# EAGLE design RAMPS_1-41_n (EAGLE 5.11)
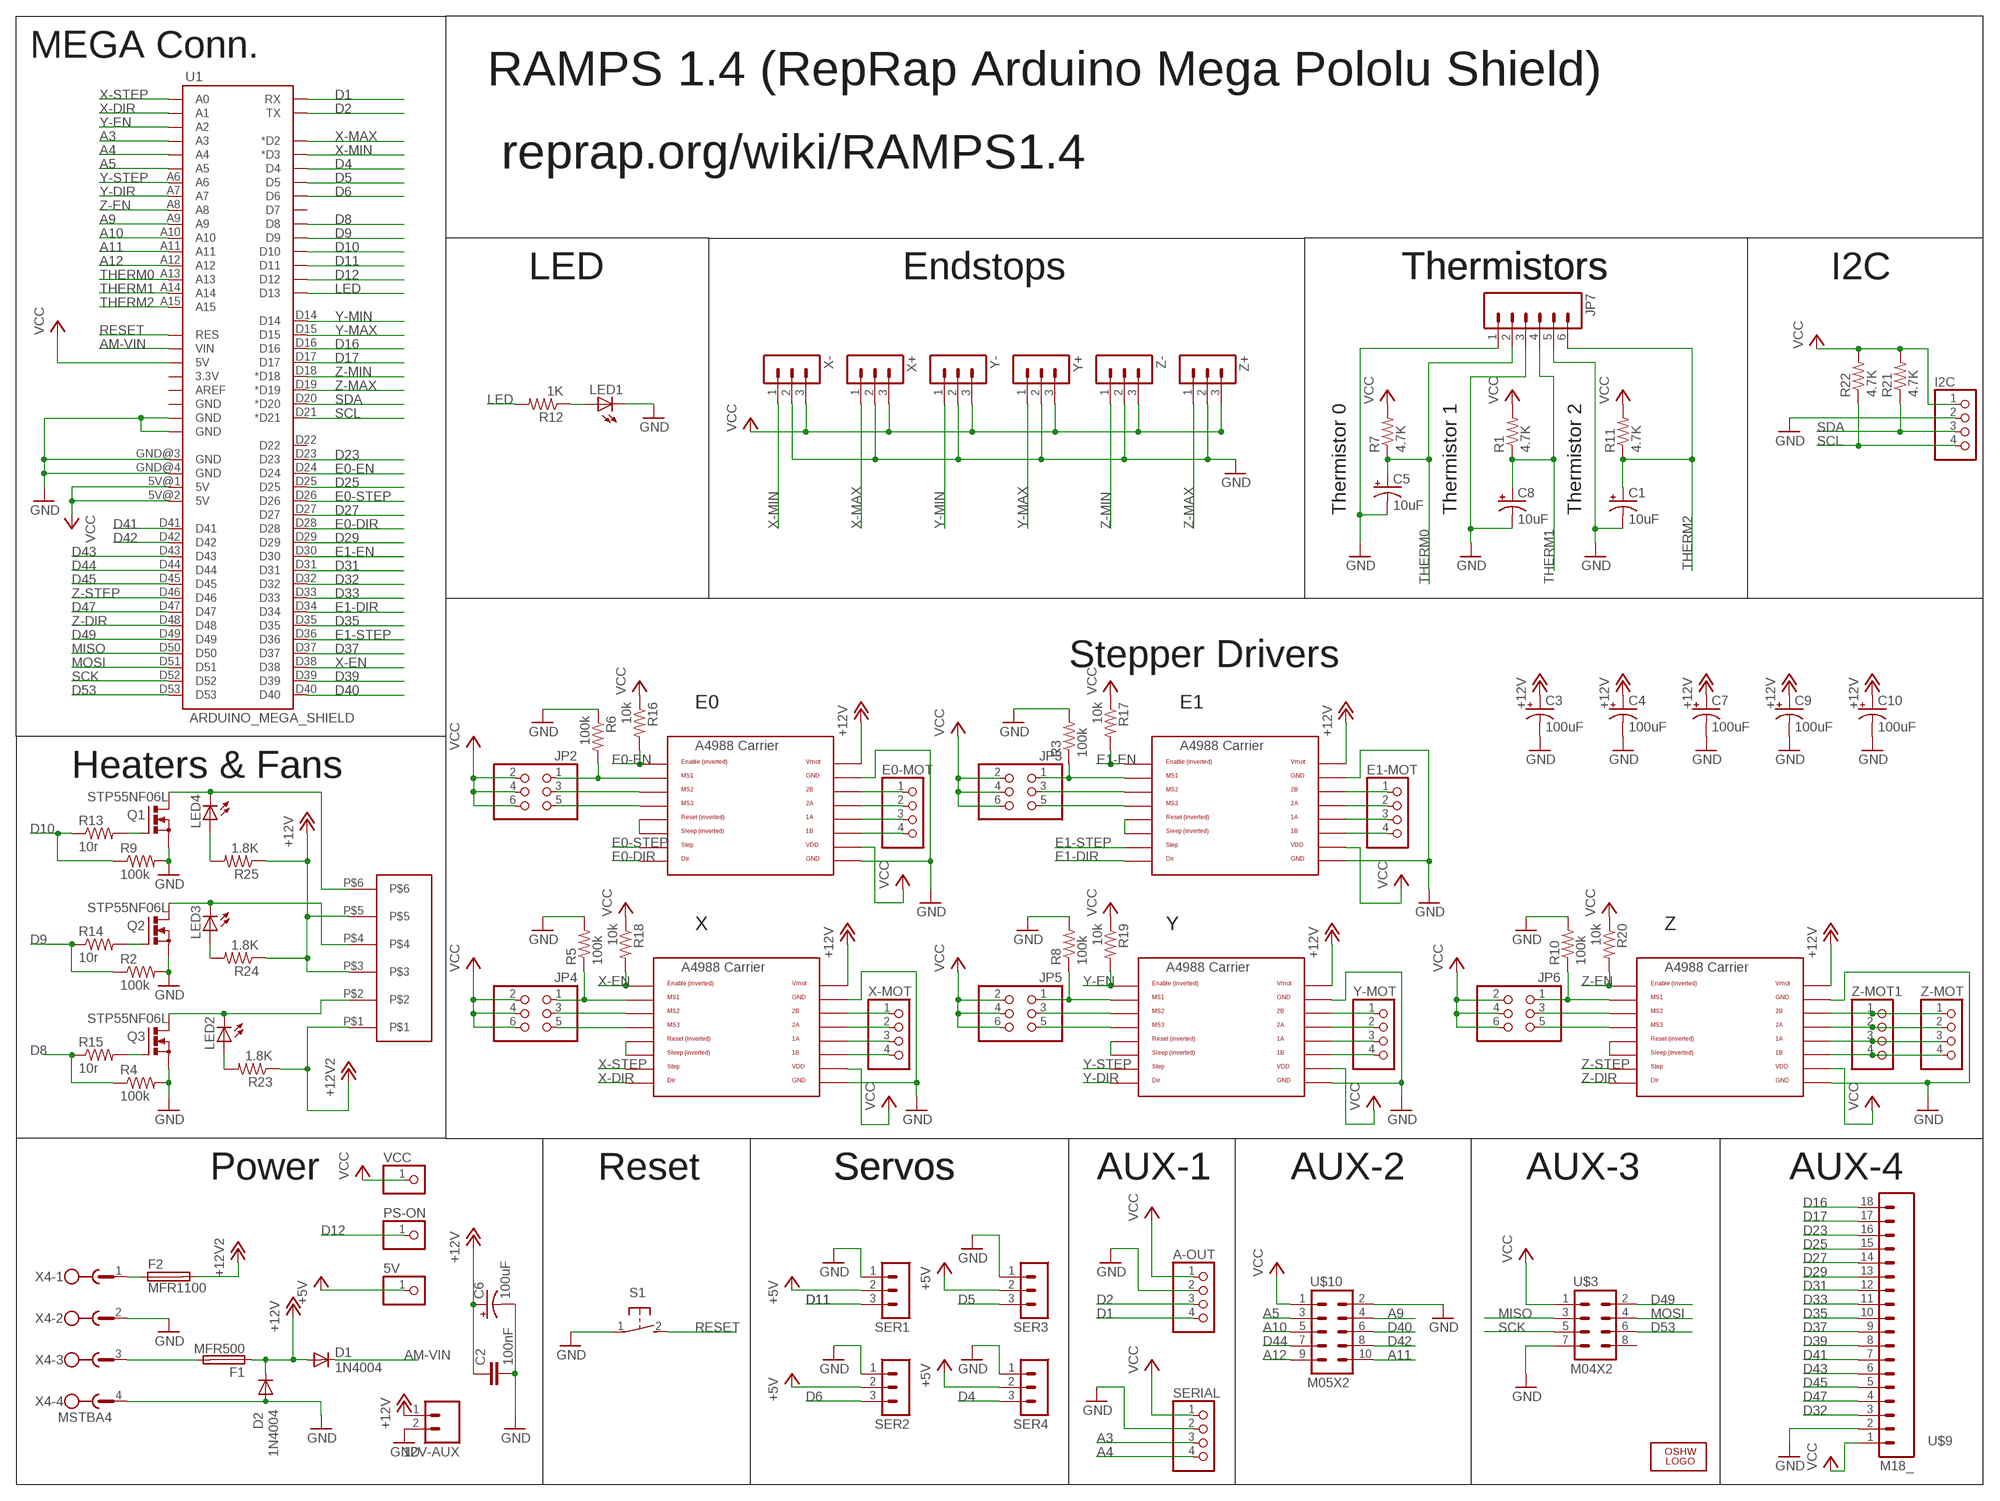
[diagram p0: schematic, sheet 1]

## Parts
5V  PINHD-1X1  [1X01]
12V-AUX  M02PTH  [1X02]
A-OUT  PINHD-1X4  [1X04]
C1  10uF  CPOL-US153CLV-0405  [153CLV-0405]
C2  100nF  C-EUC0805  [C0805]
C3  100uF  CPOL-US153CLV-0605  [153CLV-0605]
C4  100uF  CPOL-US153CLV-0605  [153CLV-0605]
C5  10uF  CPOL-US153CLV-0405  [153CLV-0405]
C6  100uF  CPOL-US153CLV-0605  [153CLV-0605]
C7  100uF  CPOL-US153CLV-0605  [153CLV-0605]
C8  10uF  CPOL-US153CLV-0405  [153CLV-0405]
C9  100uF  CPOL-US153CLV-0605  [153CLV-0605]
C10  100uF  CPOL-US153CLV-0605  [153CLV-0605]
D1  1N4004  [DO41-10]
D2  1N4004  [DO41-10]
E0-MOT  PINHD-1X4  [1X04]
E1-MOT  PINHD-1X4  [1X04]
F1  MFR500  PTCFUSE  [MFR500]
F2  MFR1100  PTCFUSEMFR1100  [MFR1100]
I2C  PINHD-1X4  [1X04]
JP2  PINHD-2X3  [2X03]
JP3  PINHD-2X3  [2X03]
JP4  PINHD-2X3  [2X03]
JP5  PINHD-2X3  [2X03]
JP6  PINHD-2X3  [2X03]
JP7  M06SIP  [1X06]
LED1  LEDCHIP-LED0805  [CHIP-LED0805]
LED2  LEDCHIP-LED0805  [CHIP-LED0805]
LED3  LEDCHIP-LED0805  [CHIP-LED0805]
LED4  LEDCHIP-LED0805  [CHIP-LED0805]
LOGO1  OSHW_LOGO_6MILX0100-NT  [OSHW_6X100_NOTEXT]
PS-ON  PINHD-1X1  [1X01]
Q1  STP55NF06L  IRF512  [TO220BV]
Q2  STP55NF06L  IRF512  [TO220BV]
Q3  STP55NF06L  IRF512  [TO220BV]
R1  4.7K  R-US_R0805  [R0805]
R2  100k  R-US_R0805  [R0805]
R3  100k  R-US_R0805  [R0805]
R4  100k  R-US_R0805  [R0805]
R5  100k  R-US_R0805  [R0805]
R6  100k  R-US_R0805  [R0805]
R7  4.7K  R-US_R0805  [R0805]
R8  100k  R-US_R0805  [R0805]
R9  100k  R-US_R0805  [R0805]
R10  100k  R-US_R0805  [R0805]
R11  4.7K  R-US_R0805  [R0805]
R12  1K  R-US_R0805  [R0805]
R13  10r  R-US_R0805  [R0805]
R14  10r  R-US_M0805  [M0805]
R15  10r  R-US_R0805  [R0805]
R16  10k  R-US_R0805  [R0805]
R17  10k  R-US_R0805  [R0805]
R18  10k  R-US_R0805  [R0805]
R19  10k  R-US_R0805  [R0805]
R20  10k  R-US_R0805  [R0805]
R21  4.7K  R-US_R0805  [R0805]
R22  4.7K  R-US_R0805  [R0805]
R23  1.8K  R-US_R0805  [R0805]
R24  1.8K  R-US_R0805  [R0805]
R25  1.8K  R-US_R0805  [R0805]
S1  31-XX  [B3F-31XX]
SER1  3PIN-HEADER  [3PIN-HEADER]
SER2  3PIN-HEADER  [3PIN-HEADER]
SER3  3PIN-HEADER  [3PIN-HEADER]
SER4  3PIN-HEADER  [3PIN-HEADER]
SERIAL  PINHD-1X4  [1X04]
U1  ARDUINO_MEGA_SHIELD  [ARDUINO_MEGA_SHIELD]
U$2  282837-6  [282837-6]
U$3  M04X2  [2X4]
U$4  A4988BREAKOUT  [A4988BREAKOUT]
U$5  A4988BREAKOUT  [A4988BREAKOUT]
U$6  A4988BREAKOUT  [A4988BREAKOUT]
U$7  A4988BREAKOUT  [A4988BREAKOUT]
U$8  A4988BREAKOUT  [A4988BREAKOUT]
U$9  M18_  [1X18]
U$10  M05X2  [2X5]
VCC  PINHD-1X1  [1X01]
X4  MSTBA4  [MSTBA4]
X+  3PIN-HEADER  [3PIN-HEADER]
X-  3PIN-HEADER  [3PIN-HEADER]
X-MOT  PINHD-1X4  [1X04]
Y+  3PIN-HEADER  [3PIN-HEADER]
Y-  3PIN-HEADER  [3PIN-HEADER]
Y-MOT  PINHD-1X4  [1X04]
Z+  3PIN-HEADER  [3PIN-HEADER]
Z-  3PIN-HEADER  [3PIN-HEADER]
Z-MOT  PINHD-1X4  [1X04]
Z-MOT1  PINHD-1X4  [1X04]

## Nets
+5V: 5V.1 SER1.2 SER2.2 SER3.2 SER4.2
+12V: 12V-AUX.1 C2.1 C3.+ C4.+ C6.+ C7.+ C9.+ C10.+ D1.A D2.C F1.1 R24.1 R25.1 U$2.P$3 U$2.P$5 U$4.VMOT U$5.VMOT U$6.VMOT U$7.VMOT U$8.VMOT
+12V2: F2.2 R23.1 U$2.P$1
A3: SERIAL.3 U1.A3
A4: SERIAL.4 U1.A4
A5: U1.A5 U$10.3
A9: U1.A9 U$10.4
A10: U1.A10 U$10.5
A11: U1.A11 U$10.10
A12: U1.A12 U$10.9
AM-VIN: D1.C U1.VIN
D1: A-OUT.4 U1.RX
D2: A-OUT.3 U1.TX
D4: SER4.3 U1.D4
D5: SER3.3 U1.D5
D6: SER2.3 U1.D6
D8: R4.1 R15.1 U1.D8
D9: R2.1 R14.1 U1.D9
D10: R9.1 R13.1 U1.D10
D11: SER1.3 U1.D11
D12: PS-ON.1 U1.D12
D16: U1.D16 U$9.18
D17: U1.D17 U$9.17
D23: U1.D23 U$9.16
D25: U1.D25 U$9.15
D27: U1.D27 U$9.14
D29: U1.D29 U$9.13
D31: U1.D31 U$9.12
D32: U1.D32 U$9.3
D33: U1.D33 U$9.11
D35: U1.D35 U$9.10
D37: U1.D37 U$9.9
D39: U1.D39 U$9.8
D40: U1.D40 U$10.6
D41: U1.D41 U$9.7
D42: U1.D42 U$10.8
D43: U1.D43 U$9.6
D44: U1.D44 U$10.7
D45: U1.D45 U$9.5
D47: U1.D47 U$9.4
D49: U1.D49 U$3.2
D53: U1.D53 U$3.6
E0-DIR: U1.D28 U$4.DIR
E0-EN: R16.2 U1.D24 U$4.EN
E0-STEP: U1.D26 U$4.STEP
E1-DIR: U1.D34 U$5.DIR
E1-EN: R17.2 U1.D30 U$5.EN
E1-STEP: U1.D36 U$5.STEP
GND: 12V-AUX.2 A-OUT.2 C1.- C2.2 C3.- C4.- C5.- C6.- C7.- C8.- C9.- C10.- D2.A I2C.2 JP7.1 JP7.3 JP7.5 LED1.C Q1.S Q2.S Q3.S R2.2 R3.2 R4.2 R5.2 R6.1 R8.2 R9.2 R10.2 S1.1(P) SER1.1 SER2.1 SER3.1 SER4.1 SERIAL.2 U1.GND@0(GND) U1.GND@1(GND) U1.GND@3(GND) U1.GND@4(GND) U$3.7 U$4.GND U$4.GND@0(GND) U$5.GND U$5.GND@0(GND) U$6.GND U$6.GND@0(GND) U$7.GND U$7.GND@0(GND) U$8.GND U$8.GND@0(GND) U$9.2 U$10.2 X4.2 X4.4 X+.2 X-.2 Y+.2 Y-.2 Z+.2 Z-.2
LED: R12.2 U1.D13
MISO: U1.D50 U$3.3
MOSI: U1.D51 U$3.4
N$1: LED3.C Q2.D U$2.P$4
N$3: E0-MOT.1 U$4.2B
N$4: E0-MOT.2 U$4.2A
N$5: JP2.1 R6.2 U$4.MS1
N$6: JP2.5 U$4.MS3
N$7: LED4.C Q1.D U$2.P$6
N$8: U$4.RST U$4.SLP(SLEEP)
N$9: JP2.3 U$4.MS2
N$10: E0-MOT.3 U$4.1A
N$11: E0-MOT.4 U$4.1B
N$12: E1-MOT.1 U$5.2B
N$13: E1-MOT.2 U$5.2A
N$14: JP4.1 R5.1 U$6.MS1
N$15: JP4.3 U$6.MS2
N$16: E1-MOT.3 U$5.1A
N$17: JP5.3 U$7.MS2
N$18: E1-MOT.4 U$5.1B
N$19: JP4.5 U$6.MS3
N$20: U$6.RST U$6.SLP(SLEEP)
N$21: U$6.2B X-MOT.1
N$22: U$6.2A X-MOT.2
N$23: U$7.RST U$7.SLP(SLEEP)
N$24: U$5.RST U$5.SLP(SLEEP)
N$25: JP3.1 R3.1 U$5.MS1
N$26: U$6.1A X-MOT.3
N$27: U$6.1B X-MOT.4
N$28: U$7.2B Y-MOT.1
N$29: U$7.2A Y-MOT.2
N$30: U$7.1A Y-MOT.3
N$31: JP5.5 U$7.MS3
N$32: LED2.A R23.2
N$33: JP5.1 R8.1 U$7.MS1
N$34: JP3.5 U$5.MS3
N$35: JP3.3 U$5.MS2
N$36: U$7.1B Y-MOT.4
N$37: JP6.3 U$8.MS2
N$38: U$8.RST U$8.SLP(SLEEP)
N$39: JP6.5 U$8.MS3
N$40: JP6.1 R10.1 U$8.MS1
N$41: U$8.2B Z-MOT1.1 Z-MOT.1
N$42: U$8.2A Z-MOT1.2 Z-MOT.2
N$43: U$8.1A Z-MOT1.3 Z-MOT.3
N$44: U$8.1B Z-MOT1.4 Z-MOT.4
N$45: LED3.A R24.2
N$46: LED1.A R12.1
N$47: Q2.G R14.2
N$48: Q1.G R13.2
N$49: Q3.G R15.2
N$50: LED4.A R25.2
N$51: LED2.C Q3.D U$2.P$2
N$53: F2.1 X4.1
N$54: F1.2 X4.3
RESET: S1.2(S) U1.RES
SCK: U1.D52 U$3.5
SCL: I2C.4 R22.1 U1.D21(*D21)
SDA: I2C.3 R21.1 U1.D20(*D20)
THERM0: C5.+ JP7.2 R7.1 U1.A13
THERM1: C8.+ JP7.4 R1.1 U1.A14
THERM2: C1.+ JP7.6 R11.1 U1.A15
VCC: A-OUT.1 I2C.1 JP2.2 JP2.4 JP2.6 JP3.2 JP3.4 JP3.6 JP4.2 JP4.4 JP4.6 JP5.2 JP5.4 JP5.6 JP6.2 JP6.4 JP6.6 R1.2 R7.2 R11.2 R16.1 R17.1 R18.1 R19.1 R20.1 R21.2 R22.2 SERIAL.1 U1.5V@0(5V) U1.5V@1(5V) U1.5V@2(5V) U$3.1 U$4.VDD U$5.VDD U$6.VDD U$7.VDD U$8.VDD U$9.1 U$10.1 VCC.1 X+.3 X-.3 Y+.3 Y-.3 Z+.3 Z-.3
X-DIR: U1.A1 U$6.DIR
X-EN: R18.2 U1.D38 U$6.EN
X-MAX: U1.D2(*D2) X+.1
X-MIN: U1.D3(*D3) X-.1
X-STEP: U1.A0 U$6.STEP
Y-DIR: U1.A7 U$7.DIR
Y-EN: R19.2 U1.A2 U$7.EN
Y-MAX: U1.D15 Y+.1
Y-MIN: U1.D14 Y-.1
Y-STEP: U1.A6 U$7.STEP
Z-DIR: U1.D48 U$8.DIR
Z-EN: R20.2 U1.A8 U$8.EN
Z-MAX: U1.D19(*D19) Z+.1
Z-MIN: U1.D18(*D18) Z-.1
Z-STEP: U1.D46 U$8.STEP
Unconnected: U1.3.3V U1.AREF U1.D7 U1.D22 U1.GND@2(GND) U$3.8

## Notes on the sheet
- MEGA Conn.
- RAMPS 1.4 (RepRap Arduino Mega Pololu Shield)
- reprap.org/wiki/RAMPS1.4
- LED | Endstops | Thermistors | Thermistors | I2C
- Thermistor 0 | Thermistor 1 | Thermistor 2
- Stepper Drivers
- E0 | E1
- Heaters & Fans
- X | Y | Z
- Power | Reset | Servos | Servos | AUX-1 | AUX-2 | AUX-3 | AUX-4

## Library data of the parts
5V PS-ON VCC = adafruit:PINHD-1X1: Pin header 1x1 for 0.1" spacing With round pins
12V-AUX = SparkFun:M02: Header 2 Standard 2-pin 0.1" header. Use with straight break away headers (SKU : PRT-00116), right angle break away headers (PRT-00553), swiss pins (PRT-00743), machine pins (PRT-00117), and female headers (PRT-00115). Molex polarized connector foot print use with SKU : PRT-08233 with associated crimp pins and housings.
A-OUT E0-MOT E1-MOT I2C SERIAL X-MOT Y-MOT Z-MOT Z-MOT1 = RepRapjr:PINHD-1X4: PIN HEADER
C1 C3-C10 = adafruit:CPOL-US: POLARIZED CAPACITOR, American symbol
C2 = resistor:C-EU: CAPACITOR, European symbol
D1 D2 = diode:1N4004: DIODE general purpose rectifier, 1 A
F1 F2 = RepRapjr:PTCFUSE: LITTLEFUSE Picofuse/slow Littlefuse
JP2-JP6 = pinhead:PINHD-2X3: PIN HEADER
JP7 = SparkFun:M06: Header 6 Standard 6-pin 0.1" header. Use with straight break away headers (SKU : PRT-00116), right angle break away headers (PRT-00553), swiss pins (PRT-00743), machine pins (PRT-00117), and female headers (PRT-00115). Molex polarized connector foot print use with SKU : PRT-08094 with associated crimp pins and housings. NOTES ON THE VARIANTS LOCK and LOCK_LONGPADS... This footprint was designed to help hold the alignment of a through-hole component (i.e. 6-pin header) while soldering it into place. You may notice that each hole has been shifted either up or down by 0.005 of an inch from it's more standard position (which is a perfectly straight line). This slight alteration caused the pins (the squares in the middle) to touch the edges of the holes. Because they are alternating, it causes a "brace" to hold the component in place. 0.005 has proven to be the perfect amount of "off-center" position when using our standard breakaway headers. Although looks a little odd when you look at the bare footprint, once you have a header in there, the alteration is very hard to notice. Also, if you push a header all the way into place, it is covered up entirely on the bottom side. This idea of altering the position of holes to aid alignment will be further integrated into the Sparkfun Library for other footprints. It can help hold any component with 3 or more connection pins.
LED1-LED4 = led:LED: LED OSRAM: - CHIPLED LG R971, LG N971, LY N971, LG Q971, LY Q971, LO R971, LY R971 LH N974, LH R974 LS Q976, LO Q976, LY Q976 LO Q996 - Hyper CHIPLED LW Q18S LB Q993, LB Q99A, LB R99A - SideLED LS A670, LO A670, LY A670, LG A670, LP A670 LB A673, LV A673, LT A673, LW A673 LH A674 LY A675 LS A676, LA A676, LO A676, LY A676, LW A676 LS A679, LY A679, LG A679 - Hyper Micro SIDELED® LS Y876, LA Y876, LO Y876, LY Y876 LT Y87S - SmartLED LW L88C, LW L88S LB L89C, LB L89S, LG L890 LS L89K, LO L89K, LY L89K LS L896, LA L896, LO L896, LY L896 - TOPLED LS T670, LO T670, LY T670, LG T670, LP T670 LSG T670, LSP T670, LSY T670, LOP T670, LYG T670 LG T671, LOG T671, LSG T671 LB T673, LV T673, LT T673, LW T673 LH T674 LS T676, LA T676, LO T676, LY T676, LB T676, LH T676, LSB T676, LW T676 LB T67C, LV T67C, LT T67C, LS T67K, LO T67K, LY T67K, LW E67C LS E67B, LA E67B, LO E67B, LY E67B, LB E67C, LV E67C, LT E67C LW T67C LS T679, LY T679, LG T679 LS T770, LO T770, LY T770, LG T770, LP T770 LB T773, LV T773, LT T773, LW T773 LH T774 LS E675, LA E675, LY E675, LS T675 LS T776, LA T776, LO T776, LY T776, LB T776 LHGB T686 LT T68C, LB T68C - Hyper Mini TOPLED® LB M676 - Mini TOPLED Santana® LG M470 LS M47K, LO M47K, LY M47K Source: http://www.osram.convergy.de LUXEON: - LUMILED® LXK2-PW12-R00, LXK2-PW12-S00, LXK2-PW14-U00, LXK2-PW14-V00 LXK2-PM12-R00, LXK2-PM12-S00, LXK2-PM14-U00 LXK2-PE12-Q00, LXK2-PE12-R00, LXK2-PE12-S00, LXK2-PE14-T00, LXK2-PE14-U00 LXK2-PB12-K00, LXK2-PB12-L00, LXK2-PB12-M00, LXK2-PB14-N00, LXK2-PB14-P00, LXK2-PB14-Q00 LXK2-PR12-L00, LXK2-PR12-M00, LXK2-PR14-Q00, LXK2-PR14-R00 LXK2-PD12-Q00, LXK2-PD12-R00, LXK2-PD12-S00 LXK2-PH12-R00, LXK2-PH12-S00 LXK2-PL12-P00, LXK2-PL12-Q00, LXK2-PL12-R00 Source: www.luxeon.com KINGBRIGHT: KA-3528ASYC Source: www.kingbright.com
LOGO1 = OSHW:OSHW_LOGO_6MIL
Q1-Q3 = transistor-power:IRF512: N-CHANNEL MOS FET
R1-R12 R16-R25 = adafruit:R-US_: RESISTOR, American symbol
R13-R15 = resistor:R-US_: RESISTOR, American symbol
S1 = switch-omron:31-XX: OMRON SWITCH; MPN: B3F-3100; OC_FARNELL: 959704; OC_NEWARK: 36M3582
SER1-SER4 X+ X- Y+ Y- Z+ Z- = ultimachine:3PIN-HEADER: PIN HEADER
U1 = RepRapjr:ARDUINO_MEGA_SHIELD
U$2 = RepRapjr:282837-6
U$3 = SparkFun:M04X2
U$4-U$8 = RepRapjr:A4988BREAKOUT
U$9 = SparkFun:M18
U$10 = RepRapjr:M05X2
X4 = con-phoenix-508:MSTBA4: PHOENIX

## Board
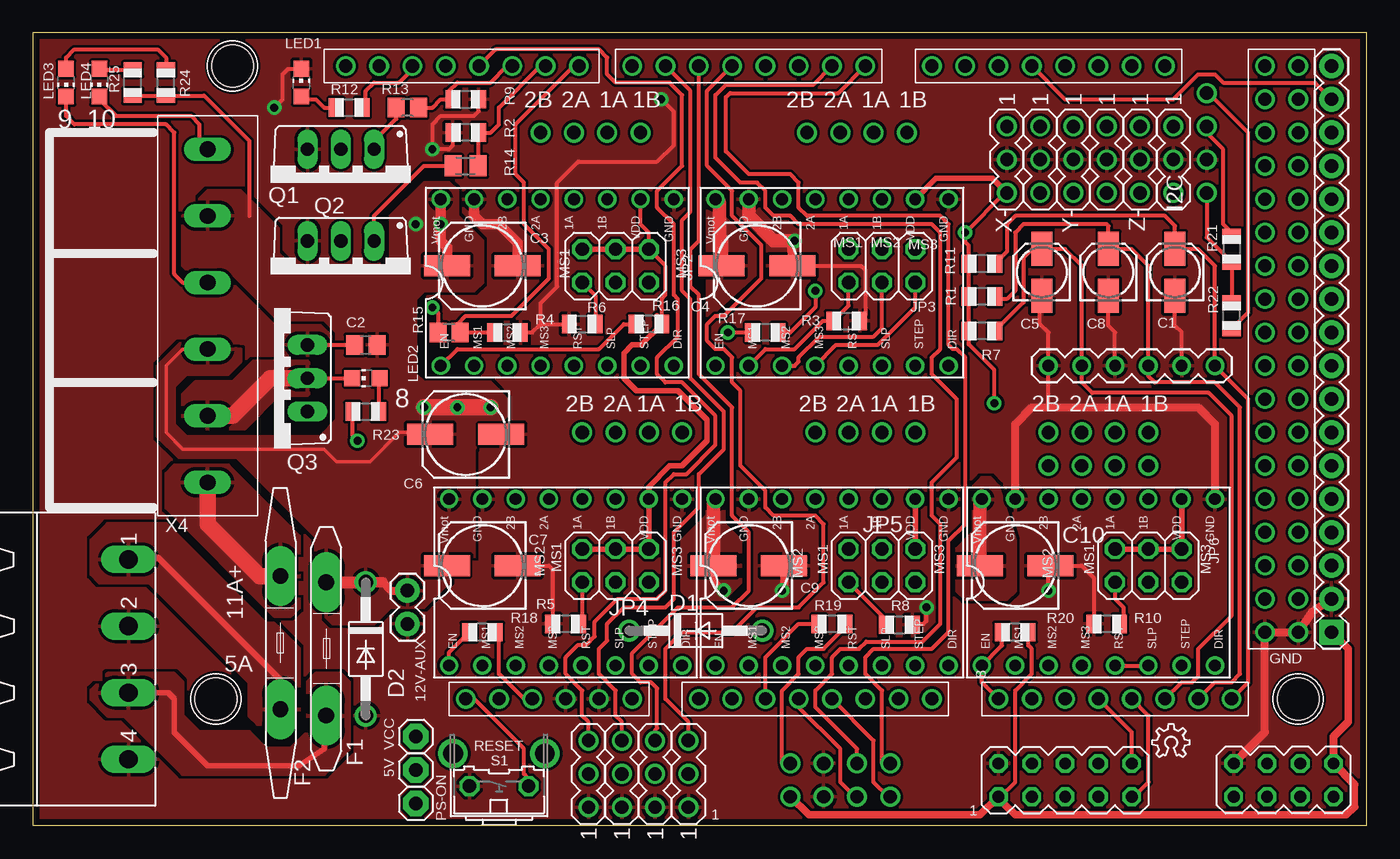
[diagram p1: board, top side]
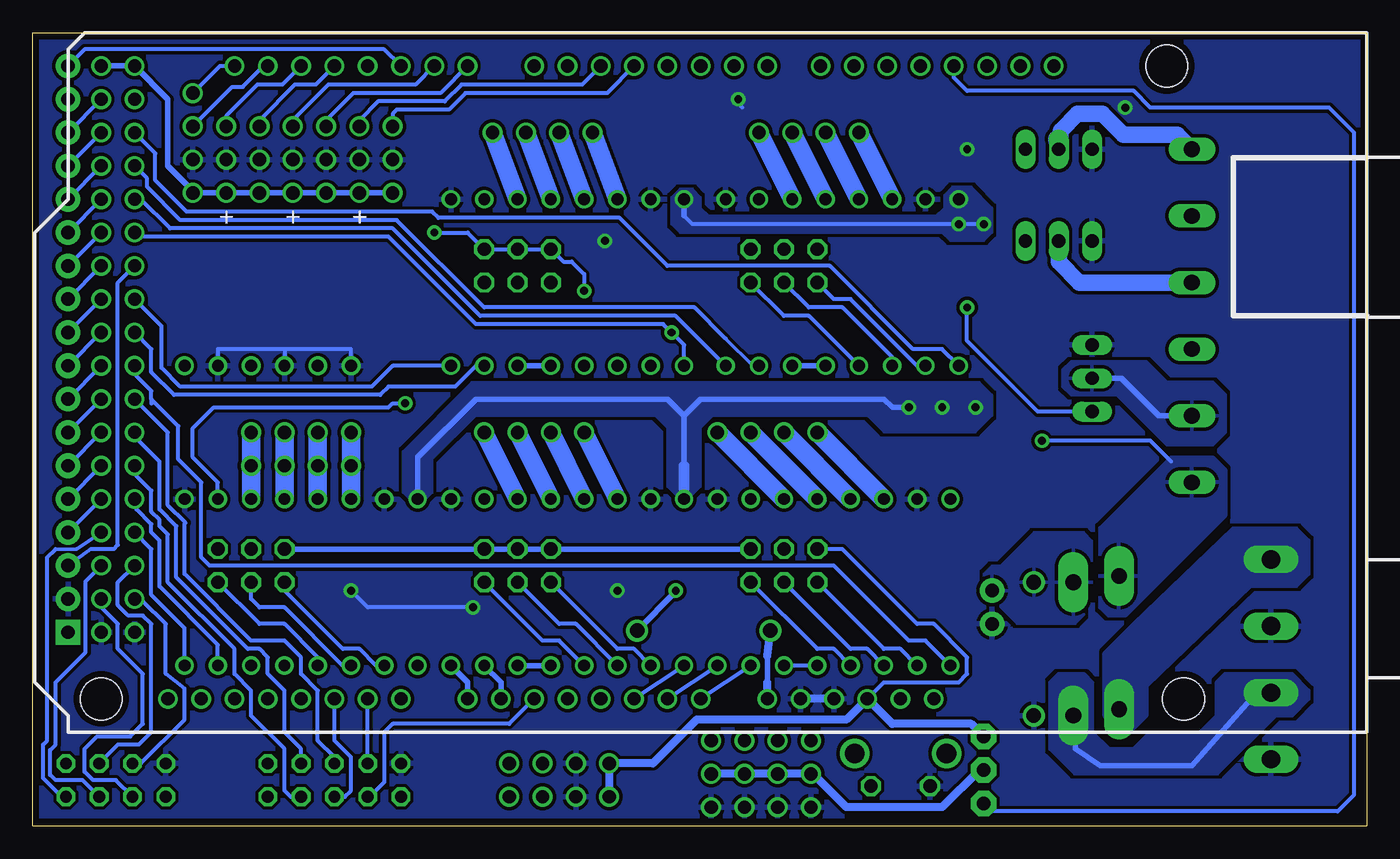
[diagram p2: board, bottom side, seen from below]

Size 101.75 x 60.47 mm. Coordinates in mm from the lower left corner, seen from the top.
Outline: 101.75,0 101.75,60.47 0,60.47 0,0 101.75,0
Copper layers (1*16): Top 0.035mm / dielectric 1.5mm / Bottom 0.035mm
Design rules "PSElectro *": minimum track width 0.2mm, minimum drill 0.4mm, track to track 0.2mm, track to pad 0.2mm, pad to pad 0.2mm, via to via 0.2mm, smd to smd 0.2mm, copper to edge 0.5mm, drill to drill 0.5mm, minimum pad ring 0.25mm, minimum via ring 0.25mm, stop-mask expansion 4mil, vias tented up to drill 100mil, thermal gap 10mil

### Footprints (pad centres in the part's own frame; a part is rotated, then mirrored left to right if it is on the bottom)
1X01 = drill 1.016 pad 1.93 octagon: 1 0,0
1X02 = drill 1.016 pad 1.88 round: 1 0,0; 2 2.54,0
1X04 = drill 1.016 round: 1 -2.54,0; 2 0,0; 3 2.54,0; 4 5.08,0
153CLV-0405 = smd 2.6 x 1.6: + 1.8,0; - -1.8,0
C0805 = smd 1.3 x 1.5: 1 -0.85,0; 2 0.85,0
153CLV-0605 = smd 3.5 x 1.6: + 2.7,0; - -2.7,0
DO41-10 = drill 1.118 round: A 5.08,0; C -5.08,0
MFR500 = drill 1.2 pad 2.3 long: 1 -5.08,0; 2 5.08,0
MFR1100 = drill 1.2 pad 2.3 long: 1 -5.08,0; 2 5.08,0
2X03 = drill 1.016 octagon: 1 -2.54,-1.27; 2 -2.54,1.27; 3 0,-1.27; 4 0,1.27; 5 2.54,-1.27; 6 2.54,1.27
1X06 = drill 0.9 pad 1.422 round: 1 0,0; 2 2.54,0; 3 5.08,0; 4 7.62,0; 5 10.16,0; 6 12.7,0
CHIP-LED0805 = smd 1.2 x 1.2: A 0,-1.05; C 0,1.05
TO220BV = drill 1.016 long: D 0,-2.54; G -2.54,-2.54; S 2.54,-2.54
R0805 = smd 1.1 x 1.4: 1 -1,0; 2 1,0
R0805' = smd 1.3 x 1.5: 1 -0.85,0; 2 0.85,0
M0805 = smd 1.3 x 1.6: 1 -0.95,0; 2 0.95,0
B3F-31XX = drill 1.016 octagon: 1 -2.261,-1.245; 2 2.261,-1.245 | drill 1.499 pad 2.159 round: 3 -3.505,1.245; 4 3.505,1.245
3PIN-HEADER = drill 1.016 round: 1 -2.54,0; 2 0,0; 3 2.54,0
ARDUINO_MEGA_SHIELD = drill 1 pad 1.422 round: 3.3V 35.56,2.54; 5V@0 38.1,2.54; 5V@1 93.98,50.8; 5V@2 96.52,50.8; A0 50.8,2.54; A1 53.34,2.54; A2 55.88,2.54; A3 58.42,2.54; A4 60.96,2.54; A5 63.5,2.54; A6 66.04,2.54; A7 68.58,2.54; A8 73.66,2.54; A9 76.2,2.54; A10 78.74,2.54; A11 81.28,2.54; A12 83.82,2.54; A13 86.36,2.54; A14 88.9,2.54; A15 91.44,2.54; AREF 23.876,50.8; D2 58.42,50.8; D3 55.88,50.8; D4 53.34,50.8; D5 50.8,50.8; D6 48.26,50.8; D7 45.72,50.8; D8 41.656,50.8; D9 39.116,50.8; D10 36.576,50.8; D11 34.036,50.8; D12 31.496,50.8; D13 28.956,50.8; D14 68.58,50.8; D15 71.12,50.8; D16 73.66,50.8; D17 76.2,50.8; D18 78.74,50.8; D19 81.28,50.8; D20 83.82,50.8; D21 86.36,50.8; D22 93.98,48.26; D23 96.52,48.26; D24 93.98,45.72; D25 96.52,45.72; D26 93.98,43.18; D27 96.52,43.18; D28 93.98,40.64; D29 96.52,40.64; D30 93.98,38.1; D31 96.52,38.1; D32 93.98,35.56; D33 96.52,35.56; D34 93.98,33.02; D35 96.52,33.02; D36 93.98,30.48; D37 96.52,30.48; D38 93.98,27.94; D39 96.52,27.94; D40 93.98,25.4; D41 96.52,25.4; D42 93.98,22.86; D43 96.52,22.86; D44 93.98,20.32; D45 96.52,20.32; D46 93.98,17.78; D47 96.52,17.78; D48 93.98,15.24; D49 96.52,15.24; D50 93.98,12.7; D51 96.52,12.7; D52 93.98,10.16; D53 96.52,10.16; GND@0 40.64,2.54; GND@1 43.18,2.54; GND@2 26.416,50.8; GND@3 93.98,7.62; GND@4 96.52,7.62; RES 33.02,2.54; RX 63.5,50.8; TX 60.96,50.8; VIN 45.72,2.54 | hole 3.2: 96.52,2.54; 13.97,2.54; 15.24,50.8
282837-6 = drill 1.2 long: P$1 0,-12.7; P$2 0,-7.62; P$3 0,-2.54; P$4 0,2.54; P$5 0,7.62; P$6 0,12.7
2X4 = drill 0.9 pad 1.422 octagon: 1 -3.81,-1.27; 2 -3.81,1.27; 3 -1.27,-1.27; 4 -1.27,1.27; 5 1.27,-1.27; 6 1.27,1.27; 7 3.81,-1.27; 8 3.81,1.27
A4988BREAKOUT = drill 0.9 round: 1A 8.89,1.27; 1B 11.43,1.27; 2A 6.35,1.27; 2B 3.81,1.27; DIR 16.51,-11.43; EN -1.27,-11.43; GND 16.51,1.27; GND@0 1.27,1.27; MS1 1.27,-11.43; MS2 3.81,-11.43; MS3 6.35,-11.43; RST 8.89,-11.43; SLP 11.43,-11.43; STEP 13.97,-11.43; VDD 13.97,1.27; VMOT -1.27,1.27
1X18 = drill 1.016 pad 1.88 square: 1 0,0 | drill 1.016 pad 1.88 round: 2 2.54,0; 3 5.08,0; 4 7.62,0; 5 10.16,0; 6 12.7,0; 7 15.24,0; 8 17.78,0; 9 20.32,0; 10 22.86,0; 11 25.4,0; 12 27.94,0; 13 30.48,0; 14 33.02,0; 15 35.56,0; 16 38.1,0; 17 40.64,0; 18 43.18,0
2X5 = drill 0.9 pad 1.422 octagon: 1 -3.81,-1.27; 2 -3.81,1.27; 3 -1.27,-1.27; 4 -1.27,1.27; 5 1.27,-1.27; 6 1.27,1.27; 7 3.81,-1.27; 8 3.81,1.27; 9 6.35,-1.27; 10 6.35,1.27
MSTBA4 = drill 1.397 long: 1 -7.62,5.08; 2 -2.54,5.08; 3 2.54,5.08; 4 7.62,5.08

### Placement (x,y rotation side)
5V  29.21,4.26 0 top
12V-AUX  28.57,17.94 270 top
A-OUT  60.33,4.76 0 top
C1  87.12,42.22 90 top
C2  25.4,36.67 180 top
C3  34.29,42.7 180 top
C4  55.24,42.7 180 top
C5  76.96,42.22 90 top
C6  33.02,29.85 180 top
C7  34.29,19.84 180 top
C8  82.04,42.22 90 top
C9  54.61,19.84 180 top
C10  74.93,19.84 180 top
D1  50.57,14.89 0 top
D2  25.4,13.49 270 top
E0-MOT  41.27,52.86 0 top
E1-MOT  61.59,52.86 0 top
F1  22.38,13.49 270 top
F2  18.89,13.97 90 top
I2C  89.53,50.8 90 top
JP2  44.45,42.7 0 top
JP3  64.77,42.7 0 top
JP4  44.45,19.84 0 top
JP5  64.77,19.84 0 top
JP6  85.09,19.84 0 top
JP7  77.47,35.08 0 top
LED1  20.48,56.67 0 top
LED2  25.4,34.13 90 top
LED3  2.54,56.67 180 top
LED4  5.08,56.67 180 top
LOGO1  85.41,5.24 0 top
PS-ON  29.21,1.72 0 top
Q1  23.49,49.05 180 top
Q2  23.49,42.07 180 top
Q3  18.42,34.13 90 top
R1  72.39,40.38 180 top
R2  33.02,52.86 180 top
R3  62.08,38.51 0 top
R4  36.2,37.62 0 top
R5  40.64,15.4 180 top
R6  41.91,38.26 0 top
R7  72.39,37.74 180 top
R8  66.1,15.34 0 top
R9  33.02,55.4 0 top
R10  81.92,15.4 180 top
R11  72.39,42.86 180 top
R12  24.13,54.77 0 top
R13  10r  [R0805']  28.57,54.77 180 top
R14  33.02,50.32 180 top
R15  10r  [R0805']  31.75,37.62 180 top
R16  46.99,38.26 180 top
R17  55.88,37.62 180 top
R18  34.29,14.76 180 top
R19  60.96,15.4 180 top
R20  74.93,14.76 180 top
R21  91.44,43.97 270 top
R22  91.44,38.89 90 top
R23  25.4,31.59 0 top
R24  10.16,56.67 90 top
R25  7.62,56.67 90 top
S1  35.56,4.29 0 top
SER1  42.39,3.97 90 top
SER2  44.93,3.97 90 top
SER3  47.47,3.97 90 top
SER4  50.01,3.97 90 top
SERIAL  60.33,2.22 0 top
U1  0,7.14 0 top
U$2  13.34,38.89 0 top
U$3  95.41,3.49 180 top
U$4  32.38,46.51 0 top
U$5  53.34,46.51 0 top
U$6  33.02,23.65 0 top
U$7  53.34,23.65 0 top
U$8  73.66,23.65 0 top
U$9  99.06,14.76 90 top
U$10  77.47,3.49 0 top
VCC  29.21,6.83 0 top
X4  2.22,12.7 270 top
X+  76.83,50.8 270 top
X-  74.3,50.8 270 top
X-MOT  44.45,30 0 top
Y+  81.92,50.8 270 top
Y-  79.38,50.8 270 top
Y-MOT  62.23,30 0 top
Z+  87,50.8 270 top
Z-  84.45,50.8 270 top
Z-MOT  80.01,30 0 top
Z-MOT1  80.01,27.46 0 top

### Tracks (layer width: path | path; a pad name or v marks a point on that pad's centre or on a via)
+5V
  Bottom 0.61: SER4.2 SER3.2 SER2.2 | SER2.2 SER1.2 42.23,3.97 39.69,1.43 32.38,1.43 29.55,4.26 5V.1 | SER2.2
+12V  (via drill 0.6)
  Top 0.254: 30.16,30 27.94,30 25.72,27.78 23.18,27.78 22.23,28.73 11.43,28.73 10.16,30 10.16,35.08 11.43,36.35 U$2.P$3
  Top 0.305: R25.1 R24.1 13.06,55.67 16.51,52.23 16.51,46.51
  Top 0.406: C9.+ 51.91,18.73 v52.7,17.94
  Top 0.61: 12V-AUX.1 27.3,17.94 26.67,18.57
  Top 0.813: D2.C 26.67,18.57 | C3.+ 31.59,44.13 31.11,44.61 U$4.VMOT | U$6.VMOT
  Top 0.914: F1.1 D2.C
  Top 1.016: C9.+ 51.91,24.76 U$7.VMOT | C10.+ 72.23,24.76 U$8.VMOT | C4.+ 52.55,44.77 52.39,44.93 52.39,47.47 U$5.VMOT
  Top 1.27: v34.92,31.91 v32.38,31.91 v29.84,31.91 | 30.16,30 C6.+
  Bottom 0.305: 52.07,46.51 51.44,45.88 v31.11,45.88 v29.21,45.88
  Bottom 0.406: U$8.VMOT 72.39,28.1 67.94,32.54 53.34,32.54 52.07,31.27 | 52.07,31.27 52.07,27.46 | 52.07,31.27 50.8,32.54 36.83,32.54 36.2,31.91 v34.92,31.91 | v52.7,17.94 52.7,17.84 D1.A | 52.07,46.51 U$5.VMOT
  Bottom 0.813: 52.07,27.46 U$7.VMOT
  pour Top: 21.59,22.07 21.59,16.67 22.86,15.4 26.04,15.4 27.3,16.67 29.84,16.67 33.66,20.48 33.66,28.73 36.2,31.27 36.2,32.54 34.92,33.81 29.84,33.81 29.21,34.45 29.21,40.16 29.84,40.8 33.66,40.8 34.29,41.43 34.29,44.61 32.38,46.51 32.38,48.42 31.75,49.05 29.84,49.05 27.3,46.51 27.3,43.02 26.67,42.39 20,42.39 18.73,43.66 18.73,45.56 15.88,48.42 13.34,48.42 11.43,46.51 11.43,42.7 12.06,42.07 15.24,42.07 18.73,38.58 22.23,38.58 23.18,37.62 23.18,30.96 21.91,29.69 11.75,29.69 10.79,30.64 10.79,33.5 11.75,34.45 14.92,34.45 15.88,35.4 15.88,36.35 11.43,36.99 9.53,35.08 9.53,29.69 11.11,28.1 15.56,28.1
  pour Bottom (no thermals): 28.57,32.86 28.57,31.27 29.84,30 36.83,30 38.1,31.27 49.85,31.27 50.8,30.32 50.8,25.88 52.07,24.61 53.34,25.88 53.34,30.32 54.29,31.27 67.94,31.27 71.28,27.94 71.28,25.4 72.39,24.29 73.5,25.4 73.5,28.58 68.26,33.81 29.53,33.81
  pour Top: 51.44,24.29 51.44,23.65 49.53,21.75 49.53,17.94 50.16,17.3 52.7,17.3 53.98,18.57 53.98,21.75 52.7,23.02 52.7,24.29 52.07,24.92
  pour Top: 71.75,25.88 71.75,22.38 70.48,21.11 70.48,17.94 71.12,17.3 74.3,17.3 74.93,17.94 74.93,21.75 73.66,25.88 73.03,26.51 72.39,26.51
  pour Top: 51.44,48.42 51.44,38.58 55.24,42.07 55.24,43.97 52.7,46.51 52.7,47.78 52.07,48.42
  pour Bottom (isolate 0.254, no thermals): 28.57,45.24 28.57,47.15 30.16,48.74 31.59,48.74 32.23,48.1 32.23,47.15 32.86,46.51 50.16,46.51 50.8,47.15 50.8,47.94 51.44,48.58 52.39,48.58 53.02,47.94 53.02,45.88 52.39,45.24 32.38,45.24 31.75,44.61 29.21,44.61
  pour Bottom: 20.95,21.75 20.95,16.67 22.23,15.4 26.67,15.4 29.21,17.94 29.21,19.21 28.57,19.84 27.94,19.84 25.4,22.38 21.59,22.38
+12V2  (via drill 0.6)
  Top 0.305: F2.2 19.05,19.21 | R23.1 24.4,29.73 v24.77,29.37
  Top 1.27: U$2.P$1 13.34,23.02 17.3,19.05 F2.2
  Bottom 0.305: v24.77,29.37 16.51,29.37 14.92,27.78
  pour Top: 10.16,26.83 10.16,24.29 18.41,16.03 19.68,16.03 20.32,16.67 20.32,22.07 14.92,27.46 10.79,27.46
  pour Bottom (isolate 0.254): 10.79,27.15 10.79,23.65 18.41,16.03 19.68,16.03 20.32,16.67 20.32,22.7 14.92,28.1 11.75,28.1
A3
  Top 0.305: U1.A3 58.42,9.05 61.59,5.87 61.59,3.33 62.71,2.22 SERIAL.3
A4
  Top 0.305: U1.A4 64.14,6.51 64.14,3.33 65.25,2.22 SERIAL.4
A5
  Bottom 0.305: U1.A5 65.41,7.78 74.3,7.78 74.93,7.14 74.93,3.33 76.04,2.22 U$10.3
A9
  Bottom 0.305: U$10.4 U1.A9
A10
  Bottom 0.305: U1.A10 78.74,6.51 77.47,5.24 77.47,2.7 77.95,2.22 U$10.5
A11
  Top 0.305: U$10.10 83.82,7.14 U1.A11
A12
  Top 0.305: U1.A12 85.09,8.41 85.09,3.33 83.98,2.22 U$10.9
AM-VIN
  Bottom 0.406: 45.72,10.95 45.72,12.97
  Bottom 0.61: 45.72,12.97 D1.C | U1.VIN 45.72,10.95
D1
  Top 0.305: U1.RX 61.44,55.88 53.18,55.88 52.86,55.56 52.86,51.44 54.61,49.69 57.78,49.69 58.42,49.05 58.42,47.15 59.05,46.51 69.22,46.51 69.85,45.88 69.85,36.67 70.17,36.35 70.48,36.35 71.12,35.72 71.12,23.02 69.85,21.75 69.85,14.76 68.58,13.49 64.14,13.49 63.5,12.86 63.5,11.59 64.77,10.32 64.77,4.76 A-OUT.4
D2
  Top 0.305: U1.TX 59.53,56.52 52.86,56.52 52.07,55.72 52.07,50.96 53.98,49.05 55.24,49.05 55.88,48.42 55.88,47.15 56.52,46.51 57.78,46.51 58.42,45.88 68.58,45.88 69.22,45.24 69.22,36.35 68.58,35.72 68.58,34.45 70.48,32.54 70.48,28.1 68.58,26.19 68.58,23.65 69.22,23.02 69.22,15.4 67.87,14.05 63.58,14.05 63.02,13.49 61.59,13.49 60.96,12.86 60.96,11.59 59.69,10.32 59.69,9.05 62.87,5.87 A-OUT.3
D4
  Top 0.305: U1.D4 51.44,56.04 51.44,50.32 53.34,48.42 53.34,46.51 55.56,44.29 55.56,41.75 52.7,38.89 52.07,38.89 51.44,38.26 51.44,36.99 52.07,36.35 52.7,36.35 53.34,35.72 53.34,33.81 53.98,33.18 53.98,27.46 55.88,25.56 55.88,24.29 56.52,23.65 59.69,23.65 60.33,23.02 60.33,18.57 58.42,16.67 55.24,16.67 53.34,14.76 49.53,14.76 48.26,13.49 48.26,9.68 50.01,7.94 SER4.3
D5
  Top 0.305: SER3.3 47.47,7.3 47.62,7.46 47.62,10.48 47.15,10.95 46.35,10.95 45.72,11.59 45.72,13.18 49.21,16.67 53.34,16.67 54.61,17.94 54.61,22.38 53.34,23.65 53.34,31.91 50.8,34.45 50.8,40.48 50.16,41.12 50.16,43.97 50.8,44.61 U1.D5
D6
  Top 0.305: U1.D6 50.16,56.04 50.16,46.83 49.53,46.2 49.53,40.8 50.16,40.16 50.16,34.13 52.7,31.59 52.7,28.73 50.8,26.83 50.8,24.29 48.9,22.38 48.9,17.3 48.26,16.67 45.09,16.67 43.81,15.4 43.81,14.13 43.18,13.49 43.18,11.59 44.45,10.32 44.45,8.41 44.93,7.94 SER2.3
D8
  Top 0.305: U1.D8 41.27,57.94 36.83,53.5 36.83,49.69 37.47,49.05 37.47,45.88 39.37,43.97 39.37,41.75 36.51,38.89 33.02,38.89 32.38,38.26 32.38,37.84 R15.1 R4.1
D9
  Top 0.305: U1.D9 38.73,57.94 35.56,54.77 35.56,53.5 34.92,52.86 R2.1 34.02,50.37 R14.1
D10
  Top 0.305: U1.D10 36.2,57.94 34.92,56.67 32.38,56.67 31.75,56.04 31.75,55.67 R9.1 31.11,55.4 30.48,54.77 R13.1
D11
  Top 0.305: SER1.3 42.39,7.94 41.91,8.41 41.91,10.32 40.64,11.59 40.64,12.86 41.59,13.81 42.23,13.81 42.86,14.45 42.86,15.56 44.61,17.3 47.62,17.3 48.26,17.94 48.26,26.19 48.9,26.83 49.85,26.83 52.07,29.05 52.07,31.27 49.53,33.81 48.26,33.81 47.62,34.45 47.62,35.72 49.21,37.31 49.21,40.16 48.9,40.48 48.9,45.88 47.62,47.15 47.62,48.42 49.53,50.32 49.53,55.72 48.58,56.67 44.45,56.67 43.81,57.31 43.81,58.58 43.18,59.21 35.31,59.21 U1.D11
D12
  Bottom 0.305: U1.D12 31.5,57.05 30.48,56.04 17.78,56.04 16.51,54.77 2.86,54.77 0.95,52.86 0.95,2.38 2.22,1.11 28.6,1.11 PS-ON.1
D16
  Bottom 0.305: U$9.18 97.79,59.21 74.93,59.21 U1.D16 | U$9.18
D17
  Top 0.305: U$9.17 97.79,56.67 90.81,56.67 90.17,57.31 88.9,57.31 87,55.4 78.74,55.4 U1.D17 | U$9.17
D23
  Bottom 0.305: U$9.16 U1.D23 | U$9.16
D25
  Bottom 0.305: U$9.15 U1.D25 | U$9.15
D27
  Bottom 0.305: U$9.14 U1.D27 | U$9.14
D29
  Bottom 0.305: U$9.13 U1.D29 | U$9.13
D31
  Bottom 0.305: U$9.12 U1.D31 | U$9.12
D32
  Bottom 0.305: U1.D32 95.25,41.43 95.25,21.43 95.57,21.11 97.31,21.11 U$9.3
D33
  Bottom 0.305: U$9.11 U1.D33 | U$9.11
D35
  Bottom 0.305: U$9.10 U1.D35 | U$9.10
D37
  Bottom 0.305: U$9.9 U1.D37 | U$9.9
D39
  Bottom 0.305: U$9.8 U1.D39
D40
  Bottom 0.305: U1.D40 91.44,30 91.44,24.45 90.09,23.1 90.17,23.02 90.17,19.21 85.09,14.13 82.55,14.13 81.28,12.86 81.28,11.59 80.01,10.32 80.01,6.51 78.74,5.24 U$10.6
D41
  Bottom 0.305: U$9.7 U1.D41 | U$9.7
D42
  Bottom 0.305: U1.D42 93.98,29.69 92.08,27.78 92.08,24.13 90.81,22.86 90.81,18.95 85.34,13.49 84.45,13.49 83.82,12.86 83.82,11.59 82.55,10.32 82.55,7.14 81.28,5.87 U$10.8
D43
  Bottom 0.305: U$9.6 U1.D43 | U$9.6
D44
  Bottom 0.305: U1.D44 93.98,26.83 92.71,25.56 92.71,23.97 92.08,23.34 92.08,22.86 91.44,22.23 91.44,18.57 86.36,13.49 86.36,11.59 85.09,10.32 85.09,8.41 82.55,5.87 82.55,2.7 82.07,2.22 U$10.7
D45
  Bottom 0.305: U$9.5 U1.D45 | U$9.5
D47
  Bottom 0.305: U$9.4 U1.D47 | U$9.4
D49
  Bottom 0.254: 100.01,21.11 98.42,21.11
  Bottom 0.305: U$3.2 99.54,2.22 100.97,3.65 100.97,6.19 100.65,6.51 100.65,20.48 100.01,21.11 | 98.42,21.11 U1.D49
D53
  Bottom 0.305: U1.D53 96.52,16.67 95.25,15.4 95.25,13.49 93.34,11.59 93.34,7.78 94.3,6.83 96.84,6.83 97.79,5.87 97.79,4.12 97.16,3.49 95.4,3.49 U$3.6
E0-DIR
  Bottom 0.305: U1.D28 93.5,47.78 91.28,45.56 74.3,45.56 67.63,38.89 52.7,38.89 U$4.DIR
E0-EN
  Top 0.305: R16.2 45.09,38.26 43.18,36.35 32.38,36.35 U$4.EN
  Bottom 0.305: U1.D24 92.39,51.28 92.39,49.21 90.01,46.83 71.28,46.83 70.8,46.35 56.99,46.35 53.34,42.7 40.96,42.7 34.61,36.35 32.38,36.35 U$4.EN
E0-STEP
  Bottom 0.254: 48.9,37.15 46.83,35.08 U$4.STEP
  Bottom 0.305: U1.D26 93.03,49.37 93.03,48.74 90.49,46.2 73.98,46.2 67.31,39.53 51.28,39.53 48.9,37.15
E1-DIR
  Bottom 0.305: U1.D34 91.92,38.1 91.92,34.92 90.49,33.5 75.88,33.5 74.3,35.08 U$5.DIR
E1-EN  (via drill 0.6)
  Top 0.305: v53.02,37.62 R17.2
  Bottom 0.305: U1.D30 93.66,44.93 74.61,44.93 67.94,38.26 53.66,38.26 v53.02,37.62 52.07,36.67 U$5.EN
E1-STEP
  Bottom 0.305: U1.D36 92.71,36.35 92.71,34.61 90.96,32.86 75.25,32.86 74.61,33.5 69.53,33.5 67.94,35.08 U$5.STEP
GND  (via drill 0.6)
  Top 0.305: R9.2 34.02,54.5 33.66,54.13 31.11,54.13 30.48,53.5 v30.48,51.59 31.75,51.59 32.02,51.86 R2.2 | C3.- 37.2,42.5 | 38.73,38.26 R6.1 | 38.73,38.26 38.1,37.62 R4.2 | LED1.C 19.46,57.72 19.05,57.31 19.05,55.4 v18.41,54.77 | R10.2 80.92,18.94 80.01,19.84 C10.- 77.47,19.68 v77.47,17.94 | C5.- 76.83,40.29 76.83,38.26 77.47,37.62 JP7.1 77.47,31.91 | R8.2 67.17,15.4 67.94,15.4 68.17,15.63 v68.17,16.67 | R5.2 39.64,19.57 39.37,19.84 C7.- | R3.2 63.5,38.93 63.5,42.39 63.18,42.7 C4.- | C8.- 82.04,38.13 82.55,37.62 JP7.3 | C1.- 87.12,38.13 87.63,37.62 JP7.5 | Q3.S C2.2 | 38.73,38.26 38.73,39.85 40.01,41.12 40.01,49.05 41.59,50.64 47.62,50.64 48.9,51.91 48.9,54.45 v47.94,55.4
  Top 0.61: U$8.GND 90.17,30.64 88.9,31.91 77.47,31.91 76.2,31.91 74.93,30.64 U$8.GND@0 | U$9.2 | U$9.2 97.63,16.35 U1.GND@4 U1.GND@3 93.98,7.14 U$3.7 | U$3.7 | 57.78,44.61 57.95,43.18 C4.- 57.95,44.45 v58.1,44.61 | v57.15,17.94 57.31,18.1 C9.- | U$6.GND@0
  Top 0.813: C3.- 36.99,44.45 35.56,45.88 34.29,45.88 33.66,46.51 U$4.GND@0
  Top 1.016: U$5.GND@0 54.61,46.51 56.52,44.61 57.78,44.61 | C10.- 77.47,20
  Top 1.422: X4.2 7.14,15.4
  Bottom 0.305: 77.47,35.4 JP7.1 77.47,36.35 82.55,36.35 | v68.17,16.67 76.2,16.67 v77.47,17.94 | 82.55,36.35 JP7.3 | 82.55,36.35 87.63,36.35 JP7.5 | v47.94,55.4 47.94,55.09 47.62,54.77
  Bottom 0.61: U1.GND@0 U1.GND@1
  Bottom 1.016: U$6.GND
  pour Top (rank 6): -1.27,61.75 102.87,61.75 102.87,-1.75 -1.27,-1.75
  pour Bottom (isolate 0.254, rank 6): -2.54,64.29 105.41,64.29 105.41,0.79 -2.54,0.79
LED
  Top 0.305: U1.D13 28.96,57.69 27.94,56.67 26.04,56.67 25.4,56.04 25.4,55.04 R12.2
MISO
  Bottom 0.305: U1.D50 95.25,18.57 95.25,16.83 94.46,16.03 93.34,16.03 92.71,15.4 92.71,7.14 93.66,6.19 95.25,6.19 U$3.3
MOSI
  Bottom 0.305: U$3.4 97.94,3.49 100.01,3.49 100.42,3.89 100.42,5.79 100.01,6.19 100.01,10.95 97.71,13.25 97.71,18.65 U1.D51
N$1
  Top 0.305: LED3.C 2.54,54.13 3.17,53.5 10.16,53.5 10.79,52.86 10.79,42.07 11.43,41.43 U$2.P$4
  Bottom 1.27: Q2.D 23.5,43.02 21.91,41.43 U$2.P$4
N$3
  Bottom 1.422: U$4.2B E0-MOT.1
N$4
  Bottom 1.422: U$4.2A E0-MOT.2
N$5
  Top 0.305: R6.2 42.91,40.43 JP2.1
  Bottom 0.305: U$4.MS1 34.29,35.08 39.37,40.16 40.64,40.16 JP2.1
N$6
  Bottom 0.305: U$4.MS3 42.55,38.89 44.45,38.89 JP2.5
N$7
  Top 0.305: LED4.C 5.08,55.4 6.35,54.13 12.06,54.13 12.7,53.5 12.7,52.23 U$2.P$6
  Bottom 1.27: 23.65,52.39 Q1.D 23.34,53.02 22.07,54.29 20.16,54.29 18.57,52.7 14.45,52.7 U$2.P$6
N$8
  Bottom 0.406: U$4.RST U$4.SLP
N$9
  Bottom 0.305: U$4.MS2 36.2,35.72 40.01,39.53 42.55,39.53 JP2.3
N$10
  Bottom 1.422: U$4.1A E0-MOT.3
N$11
  Bottom 1.422: U$4.1B E0-MOT.4
N$12
  Bottom 1.422: U$5.2B E1-MOT.1
N$13
  Bottom 1.422: U$5.2A E1-MOT.2
N$14
  Top 0.305: R5.1 41.91,15.67 JP4.1
  Bottom 0.305: U$6.MS1 35.56,13.49 36.83,13.49 JP4.1
N$15
  Bottom 0.305: U$6.MS2 38.1,13.49 39.37,13.49 JP4.3
N$16
  Bottom 1.422: U$5.1A E1-MOT.3
N$17
  Bottom 0.305: JP5.3 61.59,15.4 60.33,15.4 U$7.MS2
N$18
  Bottom 1.422: U$5.1B E1-MOT.4
N$19
  Bottom 0.305: U$6.MS3 40.64,13.49 41.91,13.49 JP4.5
N$20
  Bottom 0.305: U$6.RST U$6.SLP
N$21
  Bottom 1.422: U$6.2B X-MOT.1
N$22
  Bottom 1.422: U$6.2A X-MOT.2
N$23
  Bottom 0.406: U$7.RST U$7.SLP
N$24
  Bottom 0.406: U$5.RST U$5.SLP
N$25
  Top 0.305: U$5.MS1 55.88,36.35 58.1,36.35 60.26,38.51 R3.1 62.23,39.66 JP3.1
N$26
  Bottom 1.422: U$6.1A X-MOT.3
N$27
  Bottom 1.422: U$6.1B X-MOT.4
N$28
  Bottom 1.422: U$7.2B Y-MOT.1
N$29
  Bottom 1.422: U$7.2A Y-MOT.2
N$30
  Bottom 1.422: U$7.1A Y-MOT.3
N$31
  Bottom 0.305: JP5.5 62.87,14.13 61.59,14.13 U$7.MS3
N$32
  Top 0.305: R23.2 26.4,34.08 LED2.A
N$33
  Top 0.305: R8.1 65.1,15.7 JP5.1
  Bottom 0.305: JP5.1 57.15,13.49 55.88,13.49 U$7.MS1
N$34
  Top 0.305: JP3.5 67.31,39.53 64.45,36.67 61.28,36.67 U$5.MS3
N$35
  Top 0.305: JP3.3 64.77,37.94 64.14,37.31 60.01,37.31 58.42,35.72 58.42,35.4 58.1,35.08 U$5.MS2
N$36
  Bottom 1.422: U$7.1B Y-MOT.4
N$37
  Bottom 0.305: U$8.MS2 78.11,12.22 82.55,16.67 84.45,16.67 85.09,17.3 JP6.3
N$38
  Top 0.305: U$8.RST U$8.SLP
N$39
  Bottom 0.305: U$8.MS3 80.01,12.86 82.55,15.4 84.45,15.4 JP6.5
N$40
  Top 0.305: JP6.1 82.55,17.3 83.19,16.67 83.19,15.67 R10.1
  Bottom 0.305: U$8.MS1 75.56,12.22 76.83,13.49 78.11,13.49 82.55,17.94 JP6.1
N$41
  Bottom 1.422: U$8.2B Z-MOT1.1 Z-MOT.1
N$42
  Bottom 1.422: U$8.2A Z-MOT1.2 Z-MOT.2
N$43
  Bottom 1.422: U$8.1A Z-MOT1.3 Z-MOT.3
N$44
  Bottom 1.422: U$8.1B Z-MOT1.4 Z-MOT.4
N$45
  Top 0.305: R24.2 10.16,58.58 9.53,59.21 3.17,59.21 2.54,58.58 LED3.A
N$46
  Top 0.305: R12.1 22.23,54.77 21.59,55.4 20.7,55.4 LED1.A
N$47
  Top 0.305: R14.2 29.84,50.32 26.04,46.51 Q2.G | Q2.G
N$48
  Top 0.305: R13.2 27.73,53.92 26.04,52.23 26.04,51.44 Q1.G
N$49  (via drill 0.6)
  Top 0.305: R15.2 30.9,39.11 v30.48,39.53
  Bottom 0.305: v30.48,39.53 30.48,36.99 25.08,31.59 Q3.G
N$50
  Top 0.305: R25.2 5.13,57.67 LED4.A
N$51
  Top 0.305: LED2.C 21.91,34.13 21.59,33.81 21.27,33.81 Q3.D
  Top 1.27: U$2.P$2 15.24,31.27 18.1,34.13 Q3.D
  Bottom 0.406: U$2.P$2 15.88,31.27 18.73,34.13 Q3.D
  pour Top: 11.43,32.86 11.43,30.96 12.06,30.32 16.19,30.32 18.73,32.86 20.95,32.86 21.59,33.5 21.59,34.77 20.95,35.4 16.83,35.4 15.24,33.81 12.38,33.81
  pour Bottom: 10.79,32.86 10.79,30 11.75,29.05 15.24,29.05 19.05,32.86 22.54,32.86 23.18,33.5 23.18,34.77 22.54,35.4 16.83,35.4 15.24,33.81 11.75,33.81
N$53
  Top 0.406: X4.1 7.46,20.48 9.53,20.48 18.89,11.11 F2.1
  pour Bottom (no thermals): 4.45,21.75 4.45,19.21 5.4,18.26 8.89,18.26 16.83,10.64 16.83,8.41 17.78,7.46 19.37,7.46 20,8.41 20,13.18 17.78,15.4 10.16,22.7 5.4,22.7
  pour Top: 4.45,21.75 4.45,19.21 5.08,18.57 8.89,18.57 16.51,10.95 16.51,8.41 17.14,7.78 19.68,7.78 20.32,8.41 20.32,13.49 18.41,15.4 17.78,15.4 10.16,23.02 5.71,23.02
N$54
  Top 0.406: F1.2 22.23,8.26 22.23,5.87 20.32,4.6 13.34,4.6 10.79,7.14 10.79,9.68 10.32,10.16 X4.3
  Bottom 0.406: 8.26,10.32 13.34,4.6 20.32,4.6 22.23,5.87 22.23,8.41
  Bottom 1.422: 8.26,10.32 7.62,10.32
  pour Bottom (no thermals): 4.45,10.32 4.45,9.68 5.71,8.41 6.99,8.41 11.43,3.97 22.23,3.97 24.13,5.87 24.13,10.95 23.5,11.59 21.59,11.59 20.95,10.95 20.95,7.14 19.68,5.87 17.78,5.87 16.51,7.14 12.7,7.14 11.43,8.41 11.43,10.95 10.79,11.59 5.71,11.59
  pour Top: 4.45,10.32 4.45,9.68 5.71,8.41 6.99,8.41 11.43,3.97 22.23,3.97 24.13,5.87 24.13,10.95 23.5,11.59 21.59,11.59 20.95,10.95 20.95,7.14 19.68,5.87 17.78,5.87 16.51,7.14 12.7,7.14 11.43,8.41 11.43,10.95 10.79,11.59 5.71,11.59
RESET
  Top 0.305: S1.2 37.82,3.61 37.47,3.97 37.47,5.87 33.66,9.68 U1.RES
SCK
  Bottom 0.305: U1.D52 93.82,17.14 93.34,17.14 91.6,15.4 91.6,11.59 90.17,10.48 90.17,8.1 93.5,4.76 U$3.5
SCL
  Top 0.305: R22.1 92.71,39.16 92.71,52.86 89.69,55.88 I2C.4
  Bottom 0.305: I2C.4 87.47,57.94 U1.D21
SDA
  Top 0.305: R21.1 91.44,45.24 90.81,45.88 90.81,51.59 89.53,52.86 I2C.3
  Bottom 0.305: I2C.3 86.52,56.36 85.72,56.36 84.14,57.94 U1.D20
THERM0
  Top 0.305: U1.A13 87.63,10.95 88.42,10.95 88.9,11.43 88.9,13.49 91.44,16.03 91.44,31.27 89.69,33.02 80.8,33.02 80.01,33.81 JP7.2 80.01,42.7 78.74,43.97 77.01,43.97 C5.+ 76.25,44.02 75.56,43.34 75.56,39.91 R7.1
THERM1
  Top 0.305: U1.A14 90.17,10.95 91.44,10.95 92.08,11.59 92.08,31.91 90.17,33.81 85.57,33.81 85.09,34.29 JP7.4 85.09,42.7 83.82,43.97 82.09,43.97 C8.+ 82.04,45.75 81.92,45.88 75.56,45.88 74.93,45.24 74.93,40.8 74.3,40.16 73.6,40.16 R1.1
THERM2
  Top 0.305: U1.A15 92.71,10.95 92.71,32.54 JP7.6 | JP7.6 90.01,35.24 | R11.1 74.3,43.77 74.3,45.88 74.93,46.51 86.36,46.51 87.12,45.75 C1.+ 87.17,43.97 88.9,43.97 90.17,42.7 JP7.6
VCC  (via drill 0.6)
  Top 0.305: R18.1 35.56,14.49 35.56,11.59 37.47,9.68 U1.5V@0 | R22.2 R21.2 89.53,44.88 I2C.1 | R20.1 75.93,13.76 76.2,13.49 76.2,11.59 74.93,10.32 74.93,3.33 73.82,2.22 U$10.1 | R19.1 61.96,15.13 60.33,13.49 59.05,13.49 58.42,12.86 58.42,11.59 57.15,10.32 57.15,4.76 A-OUT.1 | X-.3 74.14,48.26 v71.12,45.24 71.12,44.51 71.39,44.24 R11.2 R1.2 R7.2 71.39,36.72 73.34,34.77 v73.34,32.23 | R17.1 57.78,37.62 59.69,39.53 v59.69,40.8 | R16.1 47.99,40.21 48.26,40.48 48.26,42.7 JP2.6 46.99,45.24 46.35,45.88 U$4.VDD
  Top 0.406: JP6.2 JP6.4 JP6.6 U$8.VDD | JP4.2 JP4.4 JP4.6 U$6.VDD | JP2.2 JP2.4 JP2.6 | X-.3 73.18,49.37 68.9,49.37 U$5.VDD | JP5.6 U$7.VDD | 47.62,38.89 47.62,38.62 R16.1 46.4,36.67 45.72,36.67 45.09,36.04 45.09,34.13 46.04,33.18 49.21,33.18 51.44,30.96 51.44,29.37 49.53,27.46 48.58,27.46 46.99,25.88 U$6.VDD | U$6.VDD
  Top 0.559: U$9.1 100.33,13.49 100.33,7.94
  Top 0.59: SERIAL.1 59.21,0.83 72.23,0.83 U$10.1 | 73.66,2.06 74.93,0.83 100.17,0.83 100.81,1.43
  Top 0.61: 100.33,7.94 99.22,6.83 U$3.1 100.81,3.17 100.81,1.43 | U$10.1 73.66,2.06
  Bottom 0.305: U$8.VDD 87.63,26.19 89.53,28.1 89.53,30.32 87.95,31.91 74.61,31.91 74.3,32.23 v73.34,32.23 | v71.12,45.24 68.58,45.24 JP3.6 JP3.4 JP3.2 61.28,43.02 60.64,43.02 59.69,42.07 v59.69,40.8 | JP4.2 40.01,21.11 34.29,15.4 33.02,15.4 30.48,12.86 30.48,11.59 31.11,10.95 36.83,10.95 U1.5V@0 | I2C.1
  Bottom 0.406: I2C.1 Z+.3 Z-.3 Y+.3 Y-.3 X+.3 X-.3 | U1.5V@2 U1.5V@1 91.44,55.4 91.44,50.32 89.53,48.42 | JP6.2 JP5.6 JP5.4 JP5.2 JP4.6
  Bottom 0.61: I2C.1 89.53,48.42 | SERIAL.1 A-OUT.1 54.45,4.76 51.12,8.1 39.69,8.1 U1.5V@0 36.2,7.78 30.16,7.78 VCC.1
X-DIR
  Bottom 0.305: U$6.DIR U1.A1
X-EN
  Top 0.305: R18.2 31.75,13.22 U$6.EN
  Bottom 0.305: U1.D38 93.98,34.45 92.71,33.18 92.71,32.54 | 92.71,32.54 92.71,32.23 | 92.71,32.54 90.65,30.48 90.65,27.94 88.9,26.19 88.9,20.48 88.27,19.84 40.64,19.84 34.92,14.13 33.66,14.13 U$6.EN
X-MAX
  Bottom 0.305: X+.1 76.83,53.82 75.41,55.24 70.33,55.24 69.06,56.52 59.85,56.52 U1.D2
X-MIN
  Bottom 0.305: X-.1 74.3,54.29 73.98,54.61 70.01,54.61 68.74,55.88 57.94,55.88 U1.D3
X-STEP
  Bottom 0.305: U$6.STEP U1.A0
Y-DIR
  Bottom 0.305: U1.A7
  Bottom 0.406: U1.A7 68.58,10.95 U$7.DIR
Y-EN
  Top 0.305: U1.A2 55.88,12.86 58.42,15.4 R19.2
  Bottom 0.305: U$7.EN U1.A2
Y-MAX
  Bottom 0.305: Y+.1 81.92,53.82 79.22,56.52 72.55,56.52 U1.D15
Y-MIN
  Bottom 0.305: Y-.1 79.38,53.82 77.31,55.88 70.64,55.88 U1.D14
Y-STEP
  Bottom 0.305: U1.A6
  Bottom 0.406: U1.A6 66.04,10.95 U$7.STEP
Z-DIR
  Bottom 0.305: U$8.DIR 90.17,15.08 92.71,17.62 92.71,21.11 U1.D48
Z-EN
  Top 0.305: U1.A8 72.39,10.95 U$8.EN 73.93,13.76 R20.2
Z-MAX
  Bottom 0.305: Z+.1 87,54.13 84.61,56.52 82.71,56.52 U1.D19
Z-MIN
  Bottom 0.305: Z-.1 84.45,53.82 81.76,56.52 80.17,56.52 U1.D18
Z-STEP
  Bottom 0.305: U$8.STEP 87.63,13.81 92.08,18.26 92.08,21.75 92.71,22.38 92.71,23.02 93.82,24.13 93.82,24.77 U1.D46
(copper drawn outside any net)
  shapes: Bottom circle x1

### Text on the board
tNames: 2B | 2A | 1A | 1B | 2B | 2A | 1A | 1B | 9 | 10 | MS1 | MS2 | MS3 | MS1 | MS3 | 8 | 2B | 2A | 1A | 1B | 2B | 2A | 1A | 1B | 2B | 2A | 1A | 1B | MS2 | MS1 | MS3 | MS2 | MS1 | MS3 | MS2 | MS1 | MS3 | 11A+ | 5A | GND | 8 | RESET | 1 | 1
bNames: + | + | + | +
_tsilk: + | I2C | END STOPS | 21 | + | E0 | 1 | S | 20 | D10 | 1 | - | - | E1 | + | + | + | D9 | T0 | T1 | T2 | + | 1 | + | D8 | 1 | 1 | 1 | U | X | Y | Z | + | + | - | 1 | + | PS | AUX-4 | AUX-1 | AUX-2 | AUX-3 | + | - | s | s | 1 | - | + | UltiMachine | GPL3 | 1 | SERVOS | 1 | reprap.org/wiki/RAMPS | V1.4 | -